# EasyEDA schematic RC-BoatController-Schematic-EASYEDA.json
TITLE: RC-Boat Transmitter; REV: 1.0; Date: 2026-02-11; Sheet: 1/1; Company: Colton Paul Badock (EvCC)
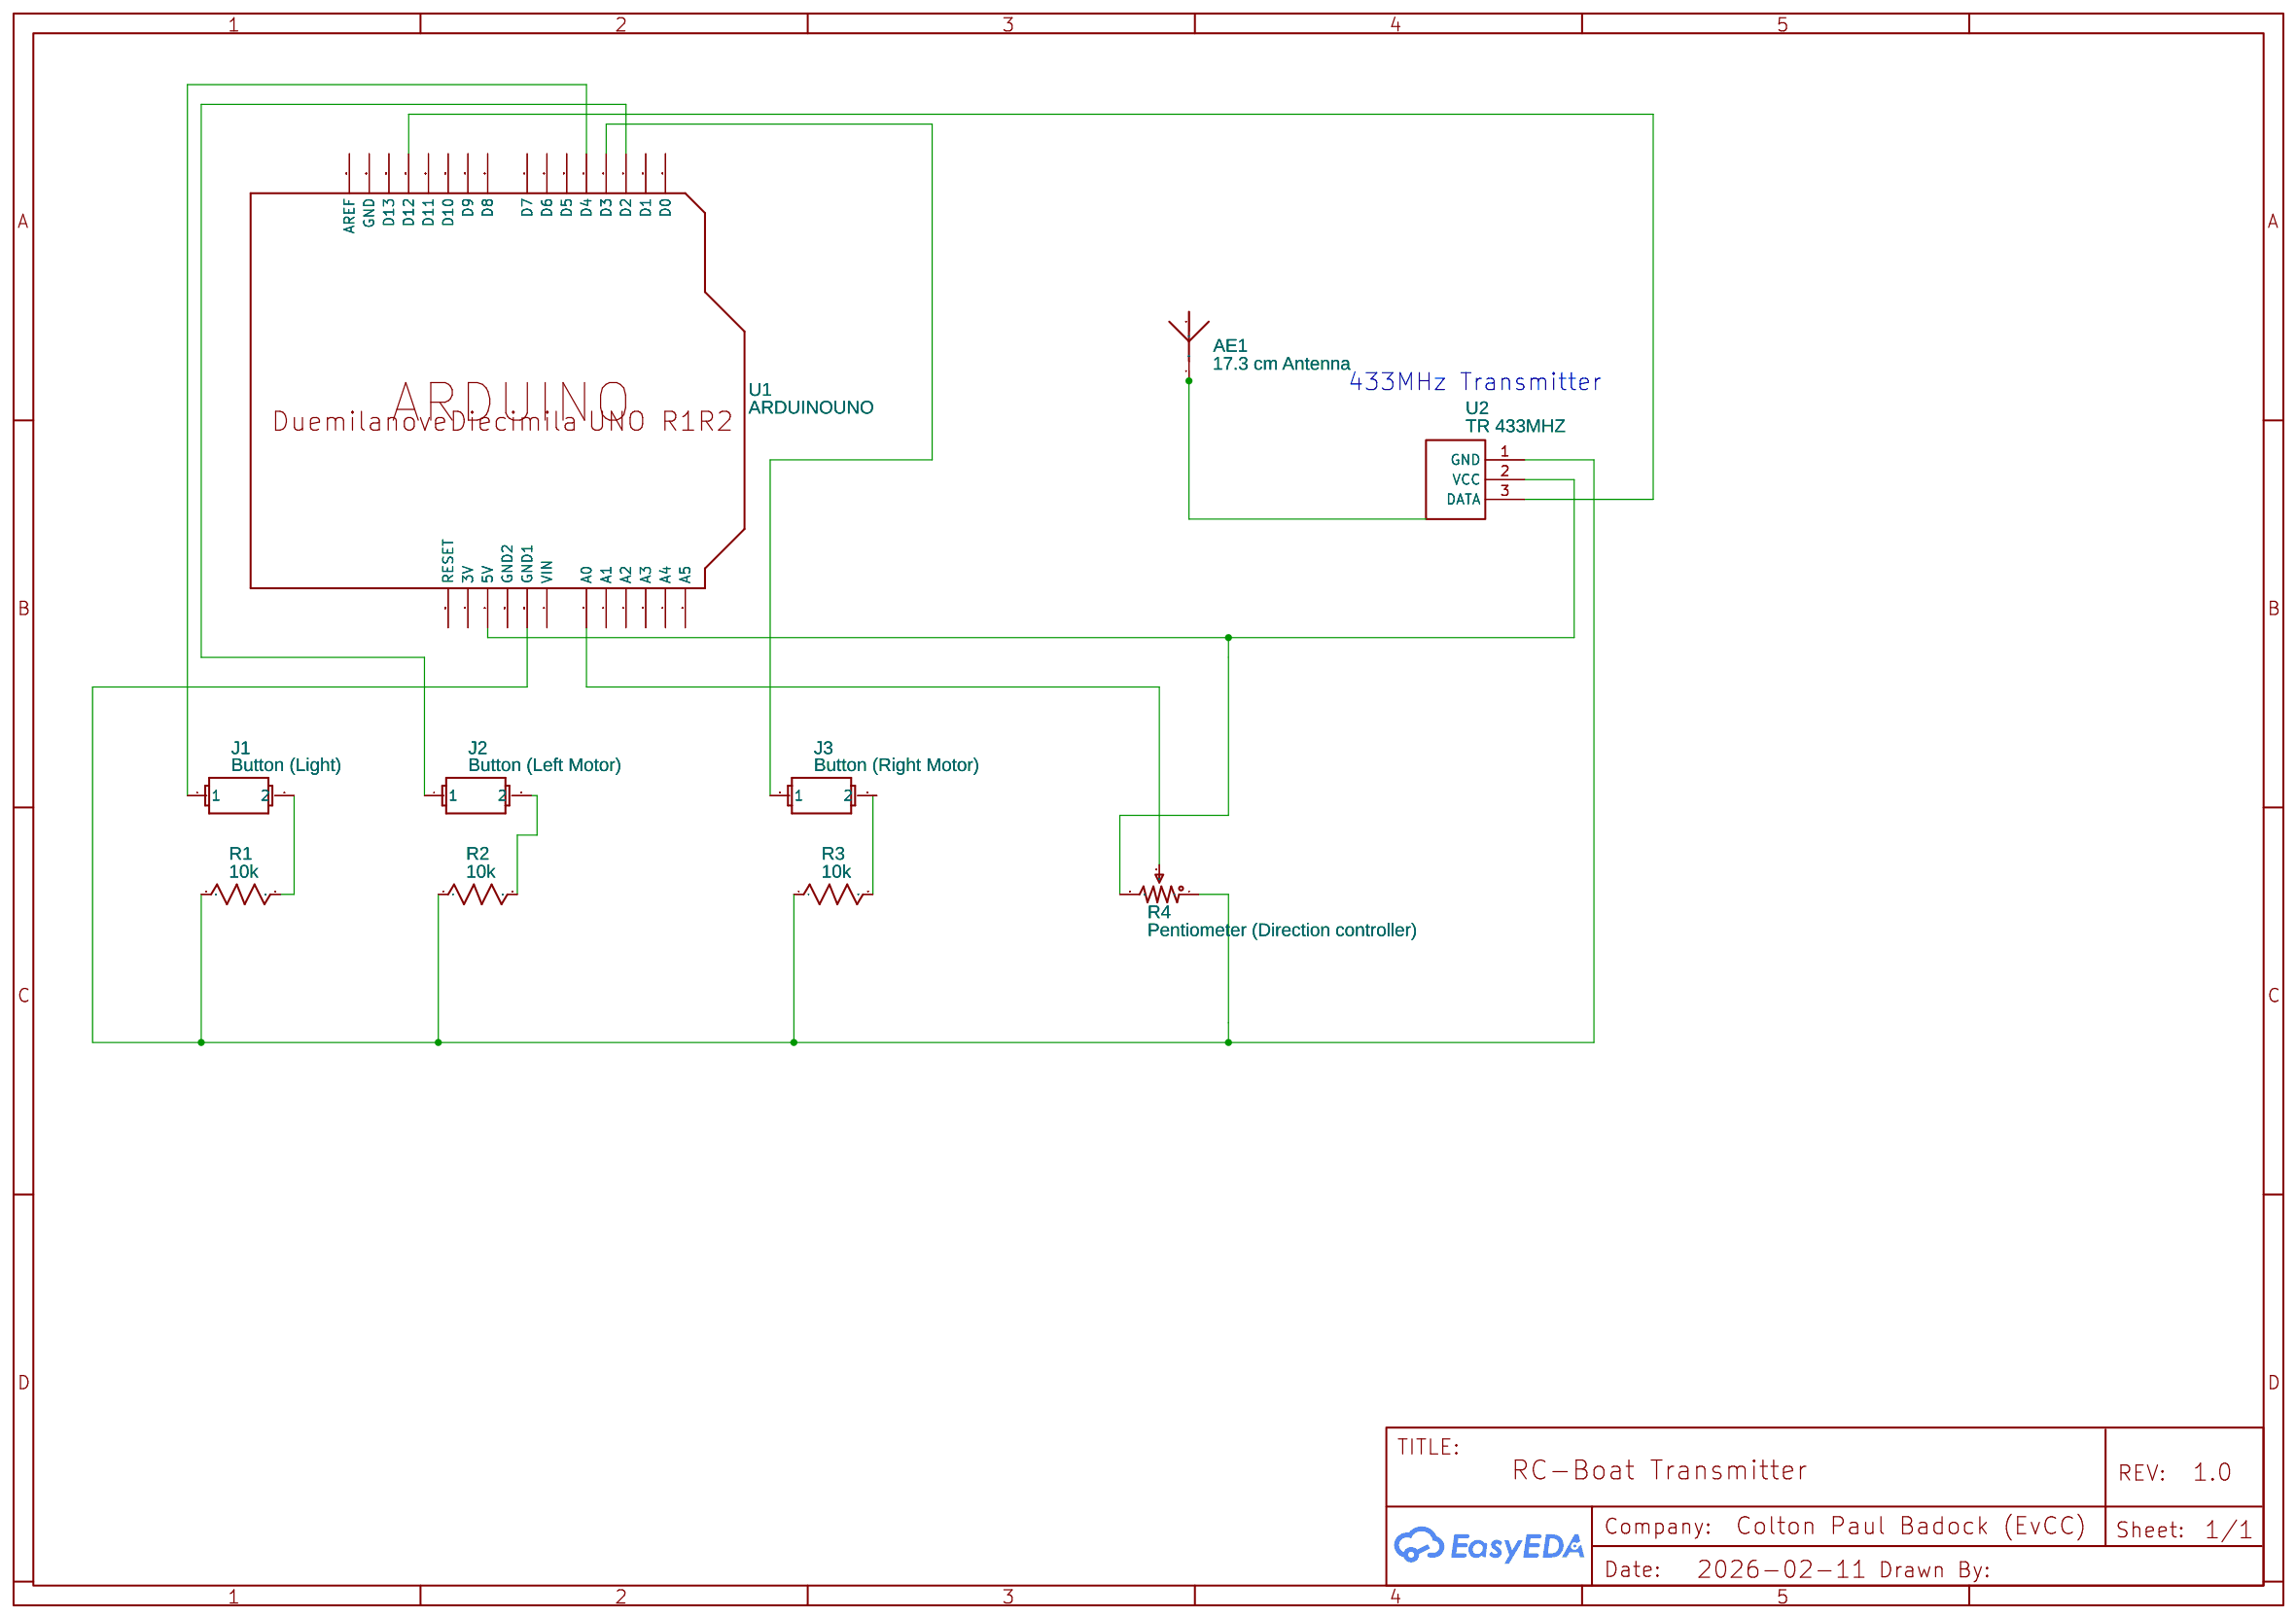
[diagram p0: schematic sheet]

## Parts
AE1  17.3 cm Antenna  [ANT-SMD_L3.2-W1.6]
J1  Button (Light)  [BUTTON_TD1183SA_BUTTON_TD1183SA]
J2  Button (Left Motor)  [BUTTON_TD1183SA_BUTTON_TD1183SA]
J3  Button (Right Motor)  [BUTTON_TD1183SA_BUTTON_TD1183SA]
R1  10k  [R0603]
R2  10k  [R0603]
R3  10k  [R0603]
R4  Pentiometer (Direction controller)  [POTENTIOMETER_TRIMMER_BOURNS_3266P]
U1  ARDUINOUNO  [ARDUINO]
U2  TR 433MHZ  [TR 433MHZ]

## Library data of the parts
AE1 = 2450AT18A100E: Contributor: LCSC; Supplier: LCSC; Supplier Part: C89334; Manufacturer: JOHANSON(约翰逊); JLCPCB Part Class: Extended Part
J1-J3 = BUTTON_TD1183SA_BUTTON_TD1183SA: Contributor: namkhanhclever862007
R1-R3 = R_0603_US: Contributor: LCEDA_Lib
R4 = Pentiometer 2.0: Supplier: LCSC; Supplier Part: C123433; Manufacturer: Chengdu Guosheng Tech; Manufacturer Part: 3266P-1-203; Contributor: LCSC
U1 = ARDUINOUNO: Arduino DiecimilaDuemilanove; Contributor: Adafruit
U2 = TR 433MHZ: Contributor: claudiu2001

## Nets
Net-(J1-1): J1.1 U1.D4
Net-(J1-2): J1.2 R1.2
Net-(J2-1): J2.1 U1.D2
Net-(J2-2): J2.2 R2.2
Net-(J3-1): J3.1 U1.D3
Net-(J3-2): J3.2 R3.2
Net-(R1-1): R1.1 R2.1 R3.1 R4.1 U1.GND1 U2.1(GND)
Net-(R4-2): R4.2 U1.A0
Net-(R4-3): R4.3 U1.5V U2.2(VCC)
Net-(U1-D12): U1.D12 U2.3(DATA)

Not connected (* = marked no-connect by the designer): AE1 1(ANT) 2; U1 3V A1 A2 A3 A4 A5 AREF D0 D1 D5 D6 D7 D8 D9 D10 D11 D13 GND GND2 RESET VIN

## Notes on the sheet
- 433MHz Transmitter
